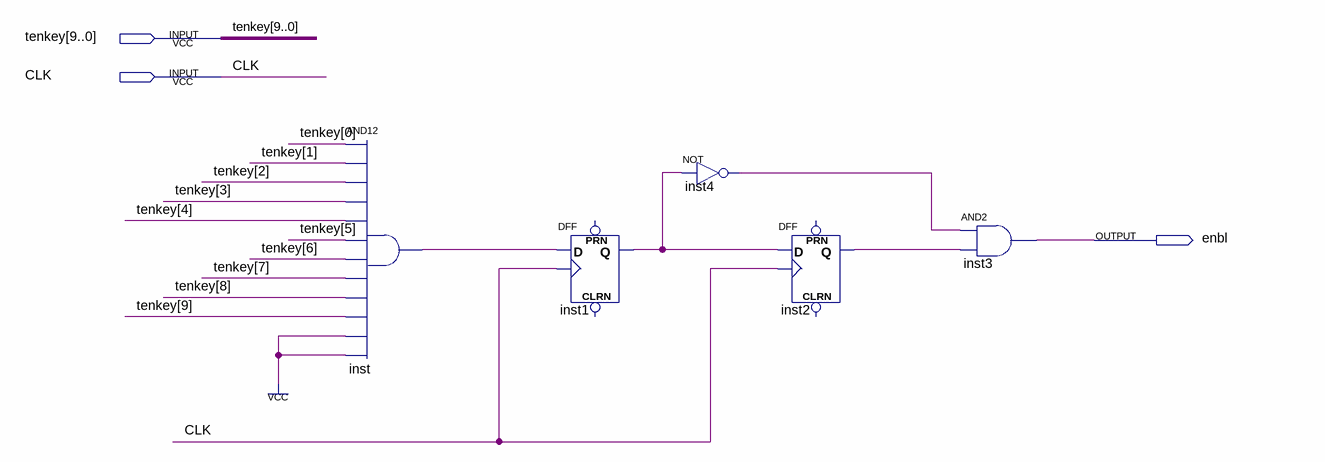
[diagram p0: schematic sheet]
// Quartus schematic keyenbl.bdf as structural Verilog: 5 symbols, 3 pins
module keyenbl (
  input  [9:0] tenkey,
  input  CLK,
  output enbl
);

  wire inst1_q, inst2_q, inst4_out, inst_out;

  and inst (inst_out, tenkey[0], tenkey[1], tenkey[2], tenkey[3], tenkey[4], tenkey[5], tenkey[6], tenkey[7], tenkey[8], tenkey[9], 1'b1, 1'b1);
  DFF inst1 (.CLK(CLK), .D(inst_out), .Q(inst1_q));  // open: CLRN, PRN
  not inst4 (inst4_out, inst1_q);
  DFF inst2 (.CLK(CLK), .D(inst1_q), .Q(inst2_q));  // open: CLRN, PRN
  and inst3 (enbl, inst4_out, inst2_q);
endmodule
